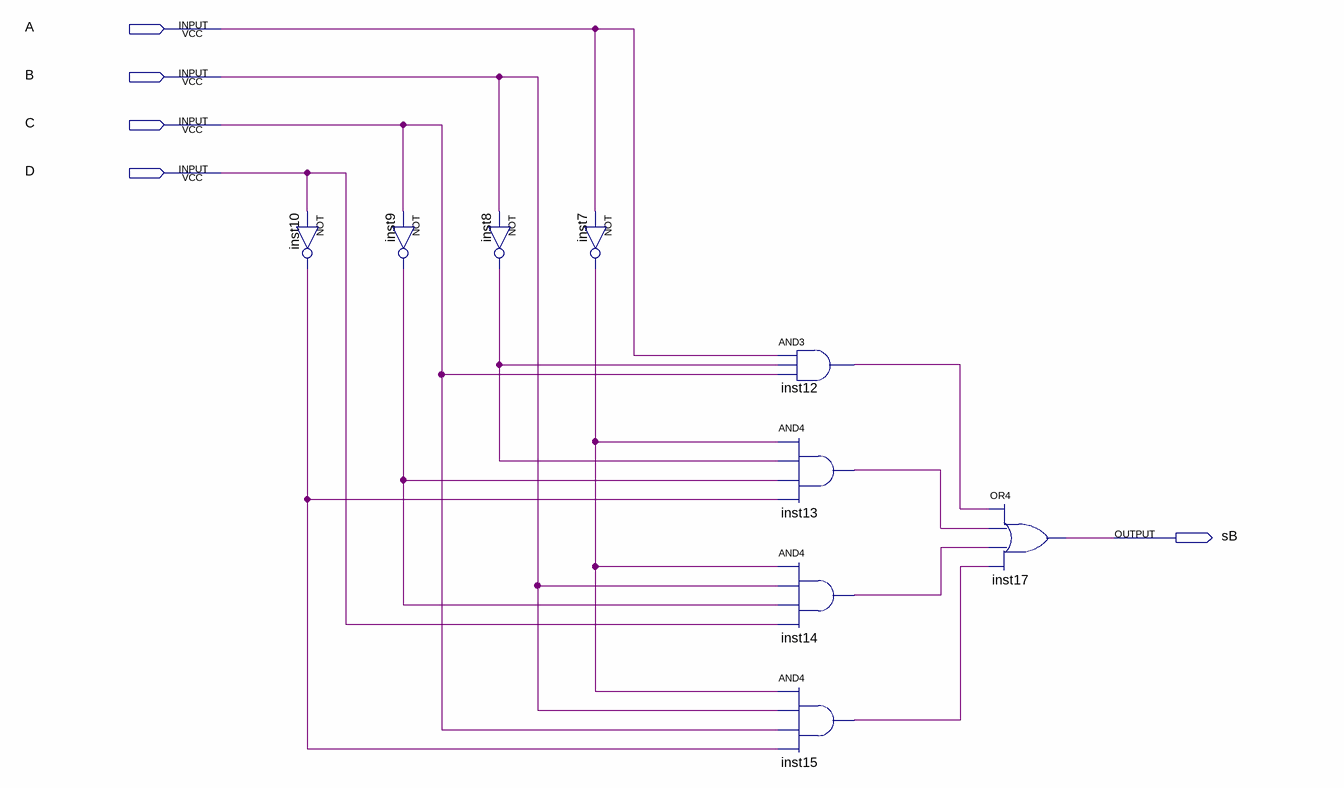
[diagram p0: schematic sheet]
// Quartus schematic decodificadorParcelaSaidaB.bdf as structural Verilog: 9 symbols, 5 pins
module decodificadorParcelaSaidaB (
  input  A,
  input  B,
  input  C,
  input  D,
  output sB
);

  wire inst7_out, inst8_out, inst9_out, inst10_out, inst12_out, inst13_out, inst14_out, inst15_out;

  not inst10 (inst10_out, D);
  not inst9 (inst9_out, C);
  not inst8 (inst8_out, B);
  not inst7 (inst7_out, A);
  and inst12 (inst12_out, A, inst8_out, C);
  and inst13 (inst13_out, inst7_out, inst8_out, inst9_out, inst10_out);
  and inst14 (inst14_out, inst7_out, B, inst9_out, D);
  and inst15 (inst15_out, inst7_out, B, C, inst10_out);
  or inst17 (sB, inst12_out, inst13_out, inst14_out, inst15_out);
endmodule
